# Altium project LEDs.PrjPCB
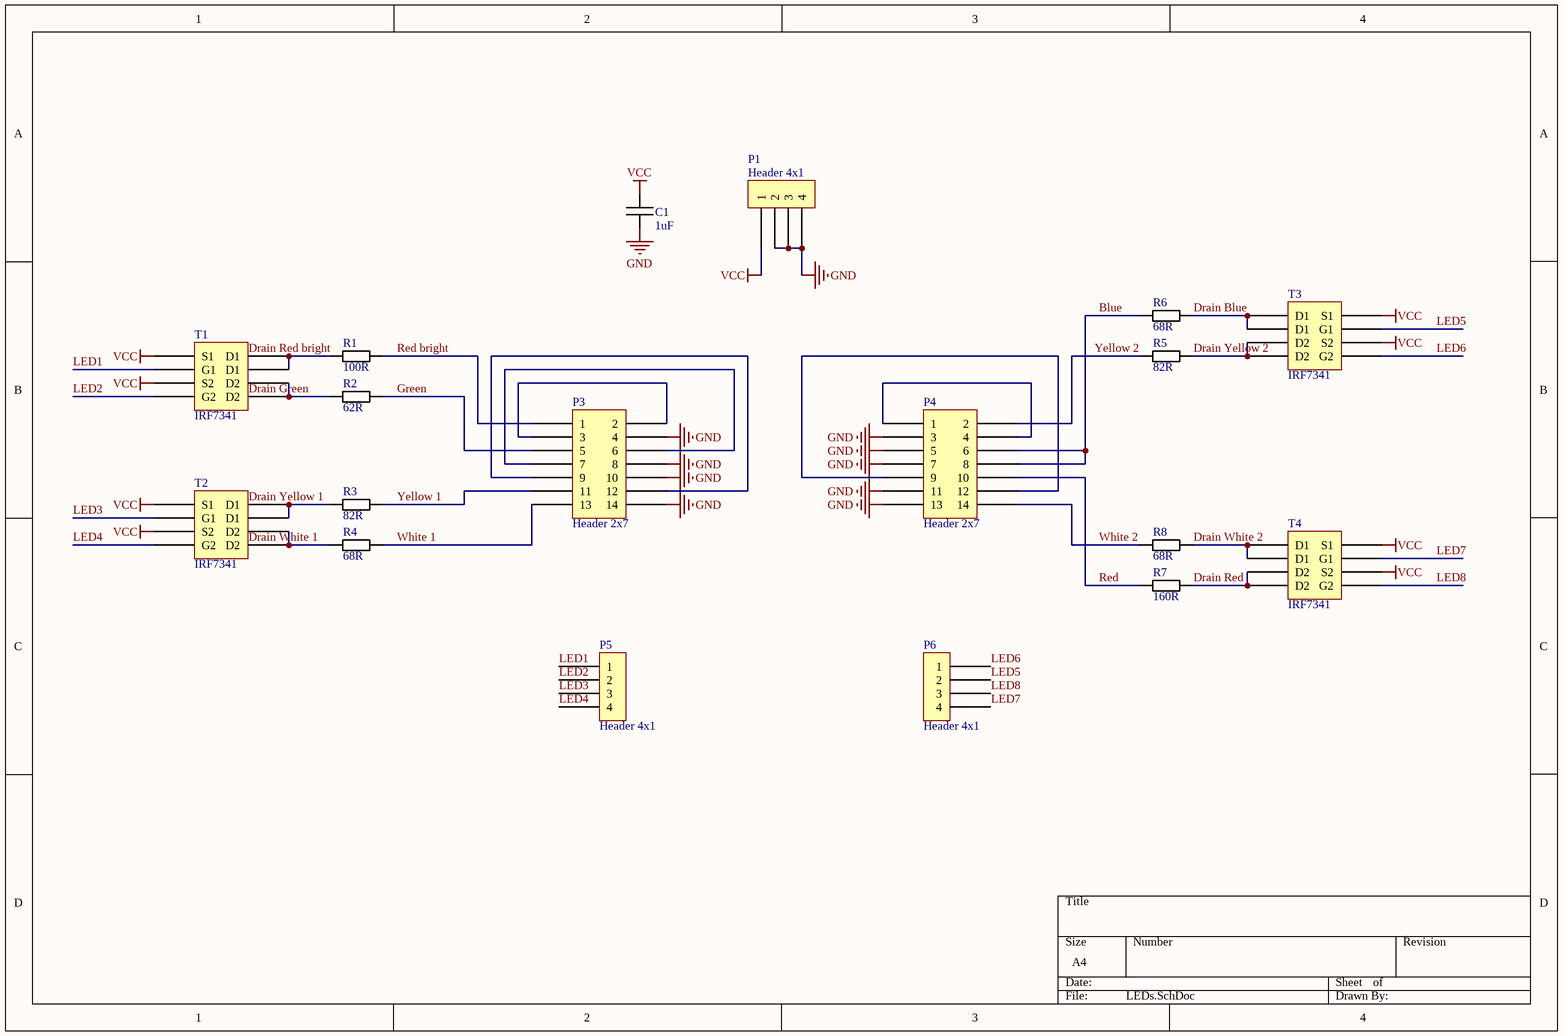
[diagram p0: LEDs.SchDoc]
1 sheet, 18 parts. Net scope: global (net labels, ports and power ports of the same name join across sheets).
Board file: LEDs.PcbDoc

## Sheet LEDs.SchDoc
size A4

### Parts
C1  1uF  [C 0805 / 2012]
P1  Header 4x1  [Header 4x1 2.54mm]
P3  Header 2x7  [Header 7x2 2.54mm]
P4  Header 2x7  [Header 7x2 2.54mm]
P5  Header 4x1  [Header 4x1 2.54mm]
P6  Header 4x1  [Header 4x1 2.54mm]
R1  100R  [R 0805 / 2012]
R2  62R  [R 0805 / 2012]
R3  82R  [R 0805 / 2012]
R4  68R  [R 0805 / 2012]
R5  82R  [R 0805 / 2012]
R6  68R  [R 0805 / 2012]
R7  160R  [R 0805 / 2012]
R8  68R  [R 0805 / 2012]
T1  IRF7341  [SOIC8]
T2  IRF7341  [SOIC8]
T3  IRF7341  [SOIC8]
T4  IRF7341  [SOIC8]

### Nets
GND: C1.2 P1.2 P1.3 P1.4 P3.4 P3.8 P3.10 P3.14 P4.3 P4.5 P4.7 P4.11 P4.13
VCC: C1.1 P1.1 T1.1(S1) T1.3(S2) T2.1(S1) T2.3(S2) T3.1(S1) T3.3(S2) T4.1(S1) T4.3(S2)
Blue: P4.6 P4.8 R6.1
Drain Blue: R6.2 T3.7(D1) T3.8(D1)
Drain Red: R7.2 T4.5(D2) T4.6(D2)
Drain White 2: R8.2 T4.7(D1) T4.8(D1)
Drain Yellow 2: R5.2 T3.5(D2) T3.6(D2)
Green: P3.5 R2.2
LED1: P5.1 T1.2(G1)
LED2: P5.2 T1.4(G2)
LED3: P5.3 T2.2(G1)
LED4: P5.4 T2.4(G2)
LED5: P6.2 T3.2(G1)
LED6: P6.1 T3.4(G2)
LED7: P6.4 T4.2(G1)
LED8: P6.3 T4.4(G2)
Red: P4.10 R7.1
Red bright: P3.1 R1.2
White 1: P3.13 R4.2
White 2: P4.14 R8.1
Yellow 1: P3.11 R3.2
Yellow 2: P4.2 R5.1
NetP3_2: P3.2 P3.3
NetP3_6: P3.6 P3.7
NetP3_9: P3.9 P3.12
NetP4_1: P4.1 P4.4
NetP4_9: P4.9 P4.12
NetR1_1: R1.1 T1.7(D1) T1.8(D1)
NetR2_1: R2.1 T1.5(D2) T1.6(D2)
NetR3_1: R3.1 T2.7(D1) T2.8(D1)
NetR4_1: R4.1 T2.5(D2) T2.6(D2)

### Notes on the sheet
- Labels drawn without touching a wire or pin: Drain Green, Drain Red bright, Drain White 1, Drain Yellow 1

### Library data of the parts
C1 = Capacitor
R1-R8 = Resistor